# Altium schematic sheet RK3566_POWER.SchDoc
size A3; SheetNumber: 15; SheetTotal: 20
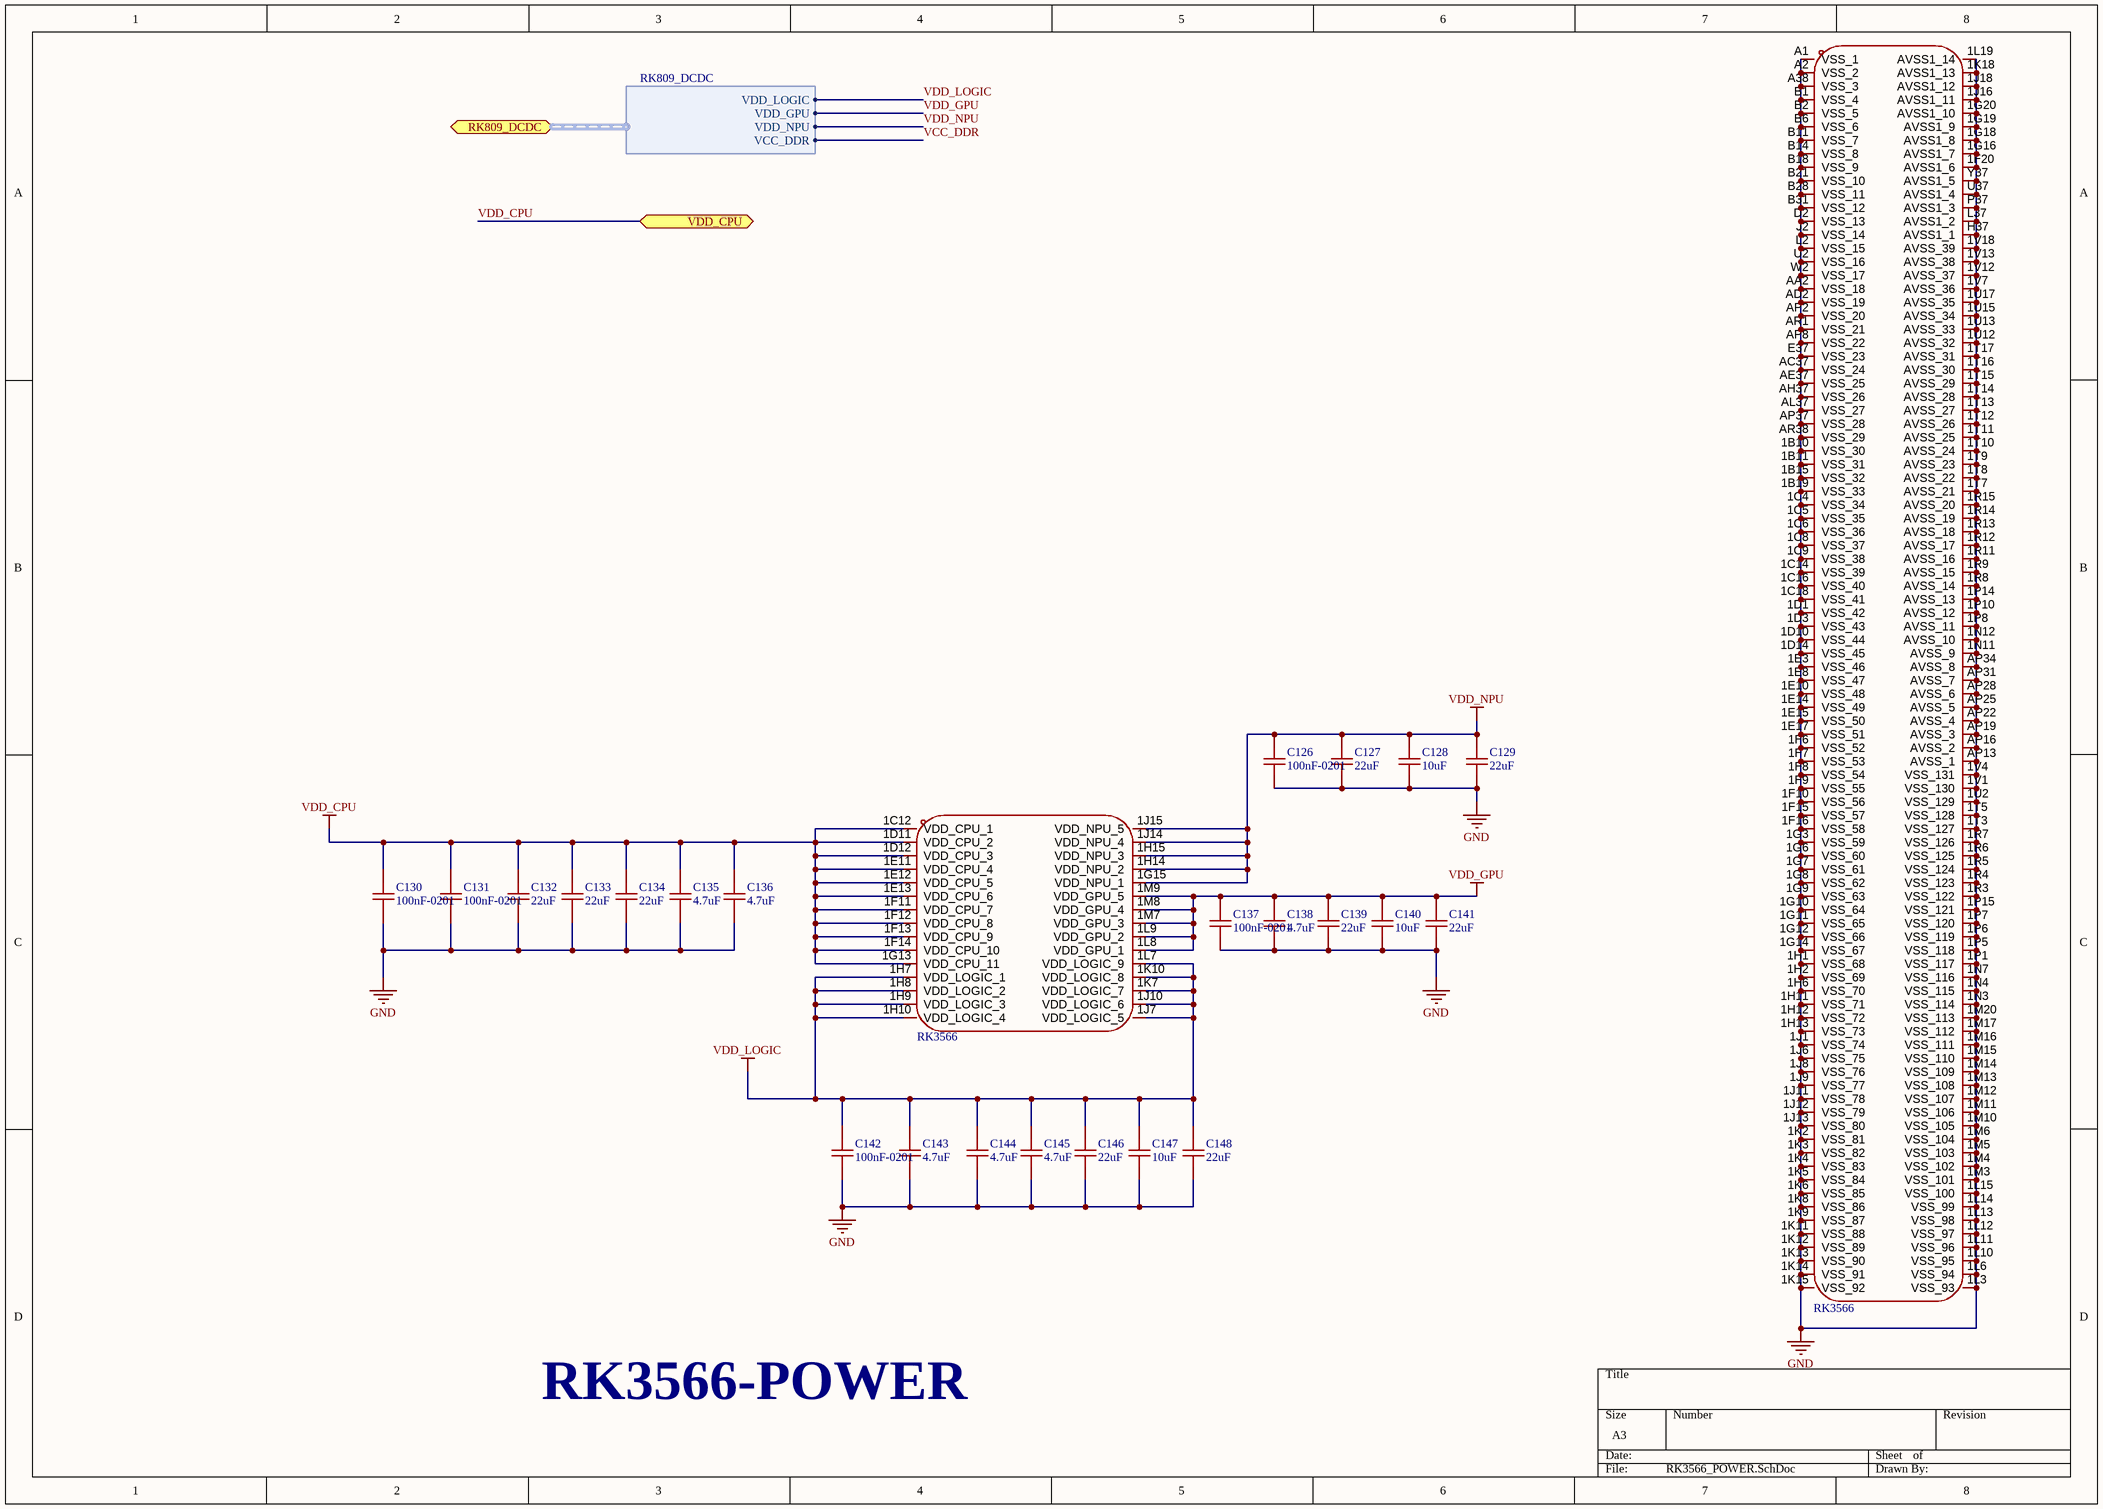
[diagram p0: RK3566_POWER.SchDoc]

## Parts
C126  100nF-0201  [C0201]
C127  22uF  [C0603]
C128  10uF  [C0603]
C129  22uF  [C0603]
C130  100nF-0201  [C0201]
C131  100nF-0201  [C0201]
C132  22uF  [C0603]
C133  22uF  [C0603]
C134  22uF  [C0603]
C135  4.7uF  [C0402]
C136  4.7uF  [C0402]
C137  100nF-0201  [C0201]
C138  4.7uF  [C0402]
C139  22uF  [C0603]
C140  10uF  [C0603]
C141  22uF  [C0603]
C142  100nF-0201  [C0201]
C143  4.7uF  [C0402]
C144  4.7uF  [C0402]
C145  4.7uF  [C0402]
C146  22uF  [C0603]
C147  10uF  [C0603]
C148  22uF  [C0603]
U2  RK3566  [BGA-565_L15.5-W14.4-P0.40_RK3566_1]  (parts A,B of 8)

## Ports
RK809_DCDC (bidir, harness RK809_DCDC, see RK3566[2D], POWER[3D], POWER_PMIC[1A], RK3566[3D]), VDD_CPU (bidir, see RK3566[2D], POWER[5D], POWER_EXTENSION[1A], RK3566[3D])

## Harnesses
RK809_DCDC: VDD_LOGIC, VDD_GPU, VDD_NPU, VCC_DDR

## Nets
GND: C126.1 C127.1 C128.1 C129.1 C130.1 C131.1 C132.1 C133.1 C134.1 C135.1 C136.1 C137.1 C138.1 C139.1 C140.1 C141.1 C142.1 C143.1 C144.1 C145.1 C146.1 C147.1 C148.1 U2.1B10(VSS_30) U2.1B11(VSS_31) U2.1B15(VSS_32) U2.1B19(VSS_33) U2.1C4(VSS_34) U2.1C5(VSS_35) U2.1C6(VSS_36) U2.1C8(VSS_37) U2.1C9(VSS_38) U2.1C14(VSS_39) U2.1C16(VSS_40) U2.1C18(VSS_41) U2.1D1(VSS_42) U2.1D3(VSS_43) U2.1D10(VSS_44) U2.1D14(VSS_45) U2.1E3(VSS_46) U2.1E8(VSS_47) U2.1E10(VSS_48) U2.1E14(VSS_49) U2.1E15(VSS_50) U2.1E17(VSS_51) U2.1F6(VSS_52) U2.1F7(VSS_53) U2.1F8(VSS_54) U2.1F9(VSS_55) U2.1F10(VSS_56) U2.1F15(VSS_57) U2.1F16(VSS_58) U2.1F20(AVSS1_6) U2.1G3(VSS_59) U2.1G6(VSS_60) U2.1G7(VSS_61) U2.1G8(VSS_62) U2.1G9(VSS_63) U2.1G10(VSS_64) U2.1G11(VSS_65) U2.1G12(VSS_66) U2.1G14(VSS_67) U2.1G16(AVSS1_7) U2.1G18(AVSS1_8) U2.1G19(AVSS1_9) U2.1G20(AVSS1_10) U2.1H1(VSS_68) U2.1H2(VSS_69) U2.1H6(VSS_70) U2.1H11(VSS_71) U2.1H12(VSS_72) U2.1H13(VSS_73) U2.1J1(VSS_74) U2.1J6(VSS_75) U2.1J8(VSS_76) U2.1J9(VSS_77) U2.1J11(VSS_78) U2.1J12(VSS_79) U2.1J13(VSS_80) U2.1J16(AVSS1_11) U2.1J18(AVSS1_12) U2.1K2(VSS_81) U2.1K3(VSS_82) U2.1K4(VSS_83) U2.1K5(VSS_84) U2.1K6(VSS_85) U2.1K8(VSS_86) U2.1K9(VSS_87) U2.1K11(VSS_88) U2.1K12(VSS_89) U2.1K13(VSS_90) U2.1K14(VSS_91) U2.1K15(VSS_92) U2.1K18(AVSS1_13) U2.1L3(VSS_93) U2.1L6(VSS_94) U2.1L10(VSS_95) U2.1L11(VSS_96) U2.1L12(VSS_97) U2.1L13(VSS_98) U2.1L14(VSS_99) U2.1L15(VSS_100) U2.1L19(AVSS1_14) U2.1M3(VSS_101) U2.1M4(VSS_102) U2.1M5(VSS_103) U2.1M6(VSS_104) U2.1M10(VSS_105) U2.1M11(VSS_106) U2.1M12(VSS_107) U2.1M13(VSS_108) U2.1M14(VSS_109) U2.1M15(VSS_110) U2.1M16(VSS_111) U2.1M17(VSS_112) U2.1M20(VSS_113) U2.1N3(VSS_114) U2.1N4(VSS_115) U2.1N7(VSS_116) U2.1N11(AVSS_9) U2.1N12(AVSS_10) U2.1P1(VSS_117) U2.1P5(VSS_118) U2.1P6(VSS_119) U2.1P7(VSS_120) U2.1P8(AVSS_11) U2.1P10(AVSS_12) U2.1P14(AVSS_13) U2.1P15(VSS_121) U2.1R3(VSS_122) U2.1R4(VSS_123) U2.1R5(VSS_124) U2.1R6(VSS_125) U2.1R7(VSS_126) U2.1R8(AVSS_14) U2.1R9(AVSS_15) U2.1R11(AVSS_16) U2.1R12(AVSS_17) U2.1R13(AVSS_18) U2.1R14(AVSS_19) U2.1R15(AVSS_20) U2.1T3(VSS_127) U2.1T5(VSS_128) U2.1T7(AVSS_21) U2.1T8(AVSS_22) U2.1T9(AVSS_23) U2.1T10(AVSS_24) U2.1T11(AVSS_25) U2.1T12(AVSS_26) U2.1T13(AVSS_27) U2.1T14(AVSS_28) U2.1T15(AVSS_29) U2.1T16(AVSS_30) U2.1T17(AVSS_31) U2.1U2(VSS_129) U2.1U12(AVSS_32) U2.1U13(AVSS_33) U2.1U15(AVSS_34) U2.1U17(AVSS_35) U2.1V1(VSS_130) U2.1V4(VSS_131) U2.1V7(AVSS_36) U2.1V12(AVSS_37) U2.1V13(AVSS_38) U2.1V18(AVSS_39) U2.A1(VSS_1) U2.A2(VSS_2) U2.A38(VSS_3) U2.AA2(VSS_18) U2.AC37(VSS_24) U2.AD2(VSS_19) U2.AE37(VSS_25) U2.AH37(VSS_26) U2.AL37(VSS_27) U2.AP2(VSS_20) U2.AP8(VSS_22) U2.AP13(AVSS_1) U2.AP16(AVSS_2) U2.AP19(AVSS_3) U2.AP22(AVSS_4) U2.AP25(AVSS_5) U2.AP28(AVSS_6) U2.AP31(AVSS_7) U2.AP34(AVSS_8) U2.AP37(VSS_28) U2.AR1(VSS_21) U2.AR38(VSS_29) U2.B1(VSS_4) U2.B2(VSS_5) U2.B6(VSS_6) U2.B11(VSS_7) U2.B14(VSS_8) U2.B18(VSS_9) U2.B21(VSS_10) U2.B28(VSS_11) U2.B31(VSS_12) U2.D2(VSS_13) U2.E37(VSS_23) U2.H37(AVSS1_1) U2.J2(VSS_14) U2.L2(VSS_15) U2.L37(AVSS1_2) U2.P37(AVSS1_3) U2.U2(VSS_16) U2.U37(AVSS1_4) U2.W2(VSS_17) U2.Y37(AVSS1_5)
VDD_CPU: C130.2 C131.2 C132.2 C133.2 C134.2 C135.2 C136.2 U2.1C12(VDD_CPU_1) U2.1D11(VDD_CPU_2) U2.1D12(VDD_CPU_3) U2.1E11(VDD_CPU_4) U2.1E12(VDD_CPU_5) U2.1E13(VDD_CPU_6) U2.1F11(VDD_CPU_7) U2.1F12(VDD_CPU_8) U2.1F13(VDD_CPU_9) U2.1F14(VDD_CPU_10) U2.1G13(VDD_CPU_11) ; port VDD_CPU
VDD_GPU: C137.2 C138.2 C139.2 C140.2 C141.2 U2.1L8(VDD_GPU_1) U2.1L9(VDD_GPU_2) U2.1M7(VDD_GPU_3) U2.1M8(VDD_GPU_4) U2.1M9(VDD_GPU_5) ; port RK809_DCDC.VDD_GPU
VDD_LOGIC: C142.2 C143.2 C144.2 C145.2 C146.2 C147.2 C148.2 U2.1H7(VDD_LOGIC_1) U2.1H8(VDD_LOGIC_2) U2.1H9(VDD_LOGIC_3) U2.1H10(VDD_LOGIC_4) U2.1J7(VDD_LOGIC_5) U2.1J10(VDD_LOGIC_6) U2.1K7(VDD_LOGIC_7) U2.1K10(VDD_LOGIC_8) U2.1L7(VDD_LOGIC_9) ; port RK809_DCDC.VDD_LOGIC
VDD_NPU: C126.2 C127.2 C128.2 C129.2 U2.1G15(VDD_NPU_1) U2.1H14(VDD_NPU_2) U2.1H15(VDD_NPU_3) U2.1J14(VDD_NPU_4) U2.1J15(VDD_NPU_5) ; port RK809_DCDC.VDD_NPU
VCC_DDR: port RK809_DCDC.VCC_DDR

## Notes on the sheet
- RK3566-POWER

## Library data of the parts
C126 C130 C131 C137 C142 = 100nF-0201: CL03A104KO3NNNC
C127 C129 C132-C134 C139 C141 C146 C148 = 22uF: 16V 22uF X5R ±20% 0603 Ceramic Capacitors ROHS
C128 C140 C147 = 10uF: 10V 10uF X5R ±10% 0603 Ceramic Capacitors ROHS
C135 C136 C138 C143-C145 = 4.7uF: 10V 4.7uF X5R ±20% 0402 Ceramic Capacitors ROHS
U2 = RK3566: BGA-565(15.5x14.4); Symbol: RK3566